# Altium schematic sheet PIC32MZ.SchDoc
size B; SheetNumber: 2; SheetTotal: 5
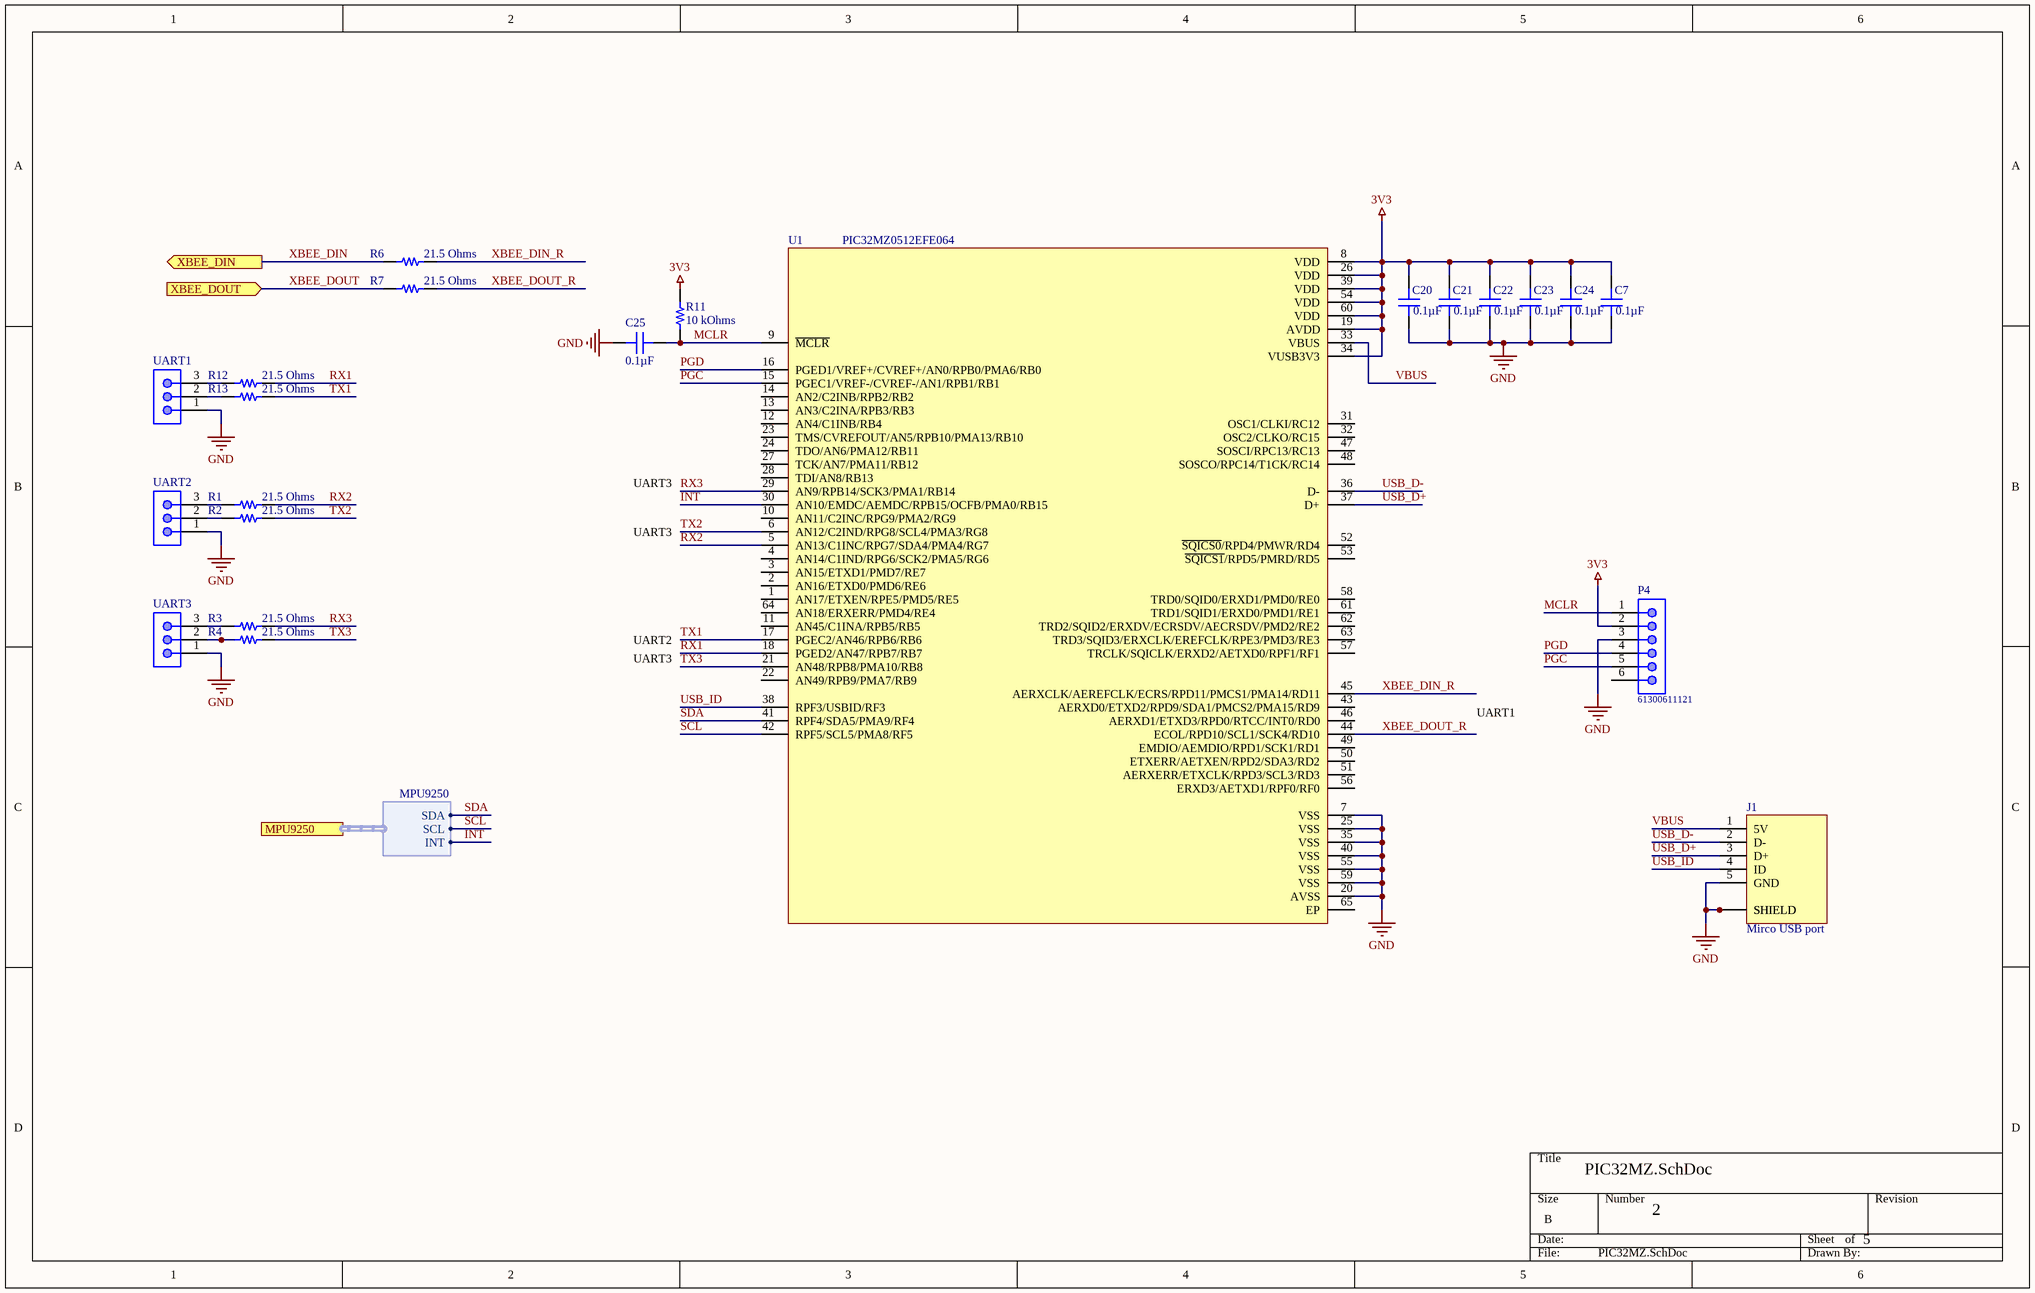
[diagram p0: PIC32MZ.SchDoc]

## Parts
C7  0.1µF  [CAP 0603_1608]
C20  0.1µF  [CAP 0603_1608]
C21  0.1µF  [CAP 0603_1608]
C22  0.1µF  [CAP 0603_1608]
C23  0.1µF  [CAP 0603_1608]
C24  0.1µF  [CAP 0603_1608]
C25  0.1µF  [CAP 0603_1608]
J1  Mirco USB port  [AMPHENOL_10118194-0001LF]
P4  61300611121  [61300611121]
R1  21.5 Ohms  [RES 0603_1608]
R2  21.5 Ohms  [RES 0603_1608]
R3  21.5 Ohms  [RES 0603_1608]
R4  21.5 Ohms  [RES 0603_1608]
R6  21.5 Ohms  [RES 0603_1608]
R7  21.5 Ohms  [RES 0603_1608]
R11  10 kOhms  [RES 0603_1608]
R12  21.5 Ohms  [RES 0603_1608]
R13  21.5 Ohms  [RES 0603_1608]
U1  PIC32MZ0512EFE064  [QFN50P900X900X100-65N]
UART1  3 pin 2mm JST Male  [3pin - 2mm header]  (value not drawn)
UART2  3 pin 2mm JST Male  [3pin - 2mm header]  (value not drawn)
UART3  3 pin 2mm JST Male  [3pin - 2mm header]  (value not drawn)

## Ports
MPU9250 (harness MPU9250), XBEE_DIN (out), XBEE_DOUT (in)

## Harnesses
MPU9250: SDA, SCL, INT

## Nets
3V3: C7.1 C20.1 C21.1 C22.1 C23.1 C24.1 P4.2 R11.2 U1.8(VDD) U1.19(AVDD) U1.26(VDD) U1.34(VUSB3V3) U1.39(VDD) U1.54(VDD) U1.60(VDD)
GND: C7.2 C20.2 C21.2 C22.2 C23.2 C24.2 C25.2 J1.5(GND) J1.S1(SHIELD) J1.S2(SHIELD) J1.S3(SHIELD) J1.S4(SHIELD) J1.S5(SHIELD) J1.S6(SHIELD) P4.3 U1.7(VSS) U1.20(AVSS) U1.25(VSS) U1.35(VSS) U1.40(VSS) U1.55(VSS) U1.59(VSS) UART1.1 UART2.1 UART3.1
INT: U1.30(AN10/EMDC/AEMDC/RPB15/OCFB/PMA0/RB15) ; port MPU9250.INT
MCLR: C25.1 P4.1 R11.1 U1.9(~{MCLR})
PGC: P4.5 U1.15(PGEC1/VREF-/CVREF-/AN1/RPB1/RB1)
PGD: P4.4 U1.16(PGED1/VREF+/CVREF+/AN0/RPB0/PMA6/RB0)
RX1: R12.2 U1.18(PGED2/AN47/RPB7/RB7)
RX2: R1.2 U1.5(AN13/C1INC/RPG7/SDA4/PMA4/RG7)
RX3: R3.2 U1.29(AN9/RPB14/SCK3/PMA1/RB14)
SCL: U1.42(RPF5/SCL5/PMA8/RF5) ; port MPU9250.SCL
SDA: U1.41(RPF4/SDA5/PMA9/RF4) ; port MPU9250.SDA
TX1: R13.2 U1.17(PGEC2/AN46/RPB6/RB6)
TX2: R2.2 U1.6(AN12/C2IND/RPG8/SCL4/PMA3/RG8)
TX3: R4.2 U1.21(AN48/RPB8/PMA10/RB8)
USB_D+: J1.3(D+) U1.37(D+)
USB_D-: J1.2(D-) U1.36(D-)
USB_ID: J1.4(ID) U1.38(RPF3/USBID/RF3)
VBUS: J1.1(5V) U1.33(VBUS)
XBEE_DIN: R6.1 ; port XBEE_DIN
XBEE_DIN_R: R6.2 U1.45(AERXCLK/AEREFCLK/ECRS/RPD11/PMCS1/PMA14/RD11)
XBEE_DOUT: R7.1 ; port XBEE_DOUT
XBEE_DOUT_R: R7.2 U1.44(ECOL/RPD10/SCL1/SCK4/RD10)
NetR1_1: R1.1 UART2.3
NetR2_1: R2.1 UART2.2
NetR3_1: R3.1 UART3.3
NetR4_1: R4.1 UART3.2
NetR12_1: R12.1 UART1.3
NetR13_1: R13.1 UART1.2

Not connected (* = marked no-connect by the designer): P4 6; U1 1(AN17/ETXEN/RPE5/PMD5/RE5) 2(AN16/ETXD0/PMD6/RE6) 3(AN15/ETXD1/PMD7/RE7) 4(AN14/C1IND/RPG6/SCK2/PMA5/RG6) 10(AN11/C2INC/RPG9/PMA2/RG9) 11(AN45/C1INA/RPB5/RB5) 12(AN4/C1INB/RB4) 13(AN3/C2INA/RPB3/RB3) 14(AN2/C2INB/RPB2/RB2) 22(AN49/RPB9/PMA7/RB9) 23(TMS/CVREFOUT/AN5/RPB10/PMA13/RB10) 24(TDO/AN6/PMA12/RB11) 27(TCK/AN7/PMA11/RB12) 28(TDI/AN8/RB13) 31(OSC1/CLKI/RC12) 32(OSC2/CLKO/RC15) 43(AERXD0/ETXD2/RPD9/SDA1/PMCS2/PMA15/RD9) 46(AERXD1/ETXD3/RPD0/RTCC/INT0/RD0) 47(SOSCI/RPC13/RC13) 48(SOSCO/RPC14/T1CK/RC14) 49(EMDIO/AEMDIO/RPD1/SCK1/RD1) 50(ETXERR/AETXEN/RPD2/SDA3/RD2) 51(AERXERR/ETXCLK/RPD3/SCL3/RD3) 52(~{SQICS0}/RPD4/PMWR/RD4) 53(~{SQICS1}/RPD5/PMRD/RD5) 56(ERXD3/AETXD1/RPF0/RF0) 57(TRCLK/SQICLK/ERXD2/AETXD0/RPF1/RF1) 58(TRD0/SQID0/ERXD1/PMD0/RE0) 61(TRD1/SQID1/ERXD0/PMD1/RE1) 62(TRD2/SQID2/ERXDV/ECRSDV/AECRSDV/PMD2/RE2) 63(TRD3/SQID3/ERXCLK/EREFCLK/RPE3/PMD3/RE3) 64(AN18/ERXERR/PMD4/RE4) 65(EP)

## Notes on the sheet
- UART3
- UART2
- UART1

## Library data of the parts
C7 C20-C25 = GCG188R92A104KA03D: CAP CER 0.1UF 100V 0603 EPOXY; Manufacturer: Murata Electronics; Temperature Coefficient: X8R; Tolerance: ±10%; Part Number: GCG188R92A104KA03D; Value: 0.1µF; Applications: Automotive; Capacitance: 0.1µF; ComponentLink1Description: Datasheet; ComponentLink1URL: https://search.murata.co.jp/Ceramy/image/img/A01X/G101/ENG/GCG188R92A104KA03-01.pdf; ComponentLink2Description: DigiKey Link; ComponentLink2URL: http://digikey.com/product-detail/en/murata-electronics/GCG188R92A104KA03D/490-18197-1-ND/9867926; Device Package: 0603 (1608 Metric); Features: Epoxy Mountable; LastUpdated: 21-Jan-20 12:01:59 AM; Lifecycle Status: Active; Minimum Order: 1; Mounting Type: Surface Mount, MLCC, Epoxy; Operating Temperature: -55°C ~ 150°C; Package / Case: 0603 (1608 Metric); Packaging: TapeAndReel; PartId: 9025; Part Status: Active; Price: 0.07; Ratings: AEC-Q200; Series: GCG; Size / Dimension: 0.063" L x 0.031" W (1.60mm x 0.80mm); Supplier 1: DigiKey; Supplier Part Number 1: 490-18197-1-ND; Thickness (Max): 0.035" (0.90mm); Voltage - Rated: 100V
J1 = 10118194-0001LF: USB - micro B USB 2.0 Receptacle Connector 5 Position Surface Mount, Right Angle; Through Hole; MF: Amphenol ICC; Package: None; Price: None; Availability: Unavailable; MP: 10118194-0001LF; SnapEDA_Link: https://www.snapeda.com/parts/10118194-0001LF/Amphenol%20FCI/view-part/1413308/?ref=snap; Value: *
P4 = 61300611121: WR-PHD Pin Header, THT, pitch 2.54mm, Single Row, Vertical, 6p; Manufacturer: Wurth Elektronik; Pin Number: 6; Rated Current: 3A; Working Voltage: 250VAC; Withstanding Voltage: 500VAC; Contact Resistance: 20mOhm; ComponentLink1Description: Manufacturer; ComponentLink1URL: http://www.we-online.de; ComponentLink2Description: Datasheet; ComponentLink2URL: https://www.we-online.com/catalog/datasheet/61300611121.pdf; Manufacturer Part Number: 61300611121; Published Date: May 2020; Pitch: 2.54mm; Operating Temperature: -40 to +105degC; Mounting Technology: THT; Packaging: Bag; Gender: Pin Header; Row Number: Single; Orientation: Vertical
R1-R4 R6 R7 R12 R13 = ERJ-3EKF21R5V: RES SMD 21.5 OHM 1% 1/10W 0603; Manufacturer: Panasonic Electronic Components; Power (Watts): 0.1W, 1/10W; Temperature Coefficient: ±100ppm/°C; Part Number: ERJ-3EKF21R5V; Value: 21.5 Ohms; ComponentLink1Description: Datasheet; ComponentLink1URL: https://industrial.panasonic.com/cdbs/www-data/pdf/RDA0000/AOA0000C304.pdf; ComponentLink2Description: DigiKey Link; ComponentLink2URL: http://digikey.com/product-detail/en/panasonic-electronic-components/ERJ-3EKF21R5V/P21.5HCT-ND/198246; Composition: Thick Film; Device Package: 0603 (1608 Metric); Features: Automotive AEC-Q200; Height - Seated (Max): 0.022" (0.55mm); LastUpdated: 21-Jan-20 12:16:19 AM; Lifecycle Status: Active; Minimum Order: 1; Number of Terminations: 2; Operating Temperature: -55°C ~ 155°C; Package / Case: 0603 (1608 Metric); Packaging: TapeAndReel; PartId: 24202; Part Status: Active; Price: 0.01; Ratings: AEC-Q200; Resistance: 21.5 Ohms; Series: ERJ; Size / Dimension: 0.063" L x 0.031" W (1.60mm x 0.80mm); Supplier 1: DigiKey; Supplier Part Number 1: P21.5HCT-ND; Supplier Device Package: 0603; Tolerance: ±1%
R11 = RNCS0603BKE10K0: RES 10K OHM 0.1% 1/16W 0603; Manufacturer: Stackpole Electronics Inc; Power (Watts): 0.063W, 1/16W; Temperature Coefficient: ±25ppm/°C; Part Number: RNCS0603BKE10K0; Value: 10 kOhms; ComponentLink1Description: Datasheet; ComponentLink1URL: https://www.seielect.com/catalog/sei-rncs_rnch.pdf; ComponentLink2Description: DigiKey Link; ComponentLink2URL: http://digikey.com/product-detail/en/stackpole-electronics-inc/RNCS0603BKE10K0/RNCS0603BKE10K0CT-ND/1800113; Composition: Thin Film; Device Package: 0603 (1608 Metric); Features: Anti-Corrosive, Automotive AEC-Q200, Moisture Resistant; Height - Seated (Max): 0.022" (0.55mm); LastUpdated: 13-Aug-20 10:37:13 AM; Lifecycle Status: Active; Minimum Order: 1; Number of Terminations: 2; Operating Temperature: -55°C ~ 155°C; Package / Case: 0603 (1608 Metric); Packaging: TapeAndReel; PartId: 4838; Part Status: Active; Price: 0.08; Ratings: AEC-Q200; Resistance: 10 kOhms; Series: RNCS; Size / Dimension: 0.061" L x 0.031" W (1.55mm x 0.80mm); Supplier 1: DigiKey; Supplier Part Number 1: RNCS0603BKE10K0CT-ND; Supplier Device Package: 0603; Tolerance: ±0.1%
U1 = PIC32MZ0512EFE064-I/PT: 32-bit Microcontrollers - MCU 32-BIT MCU 512KB FL 128KB RAM, No Crypto; MF: Microchip; MP: PIC32MZ2048EFG064T-I/PT; Price: None; Value: *; SnapEDA_Link: https://www.snapeda.com/parts/PIC32MZ2048EFG064T-I/PT/Microchip/view-part/565997/?ref=snap; Package: TQFP-64 Microchip; Availability: Unavailable